# Altium schematic sheet IRIS-EXT-04-BRK_Top.SchDoc
size A3
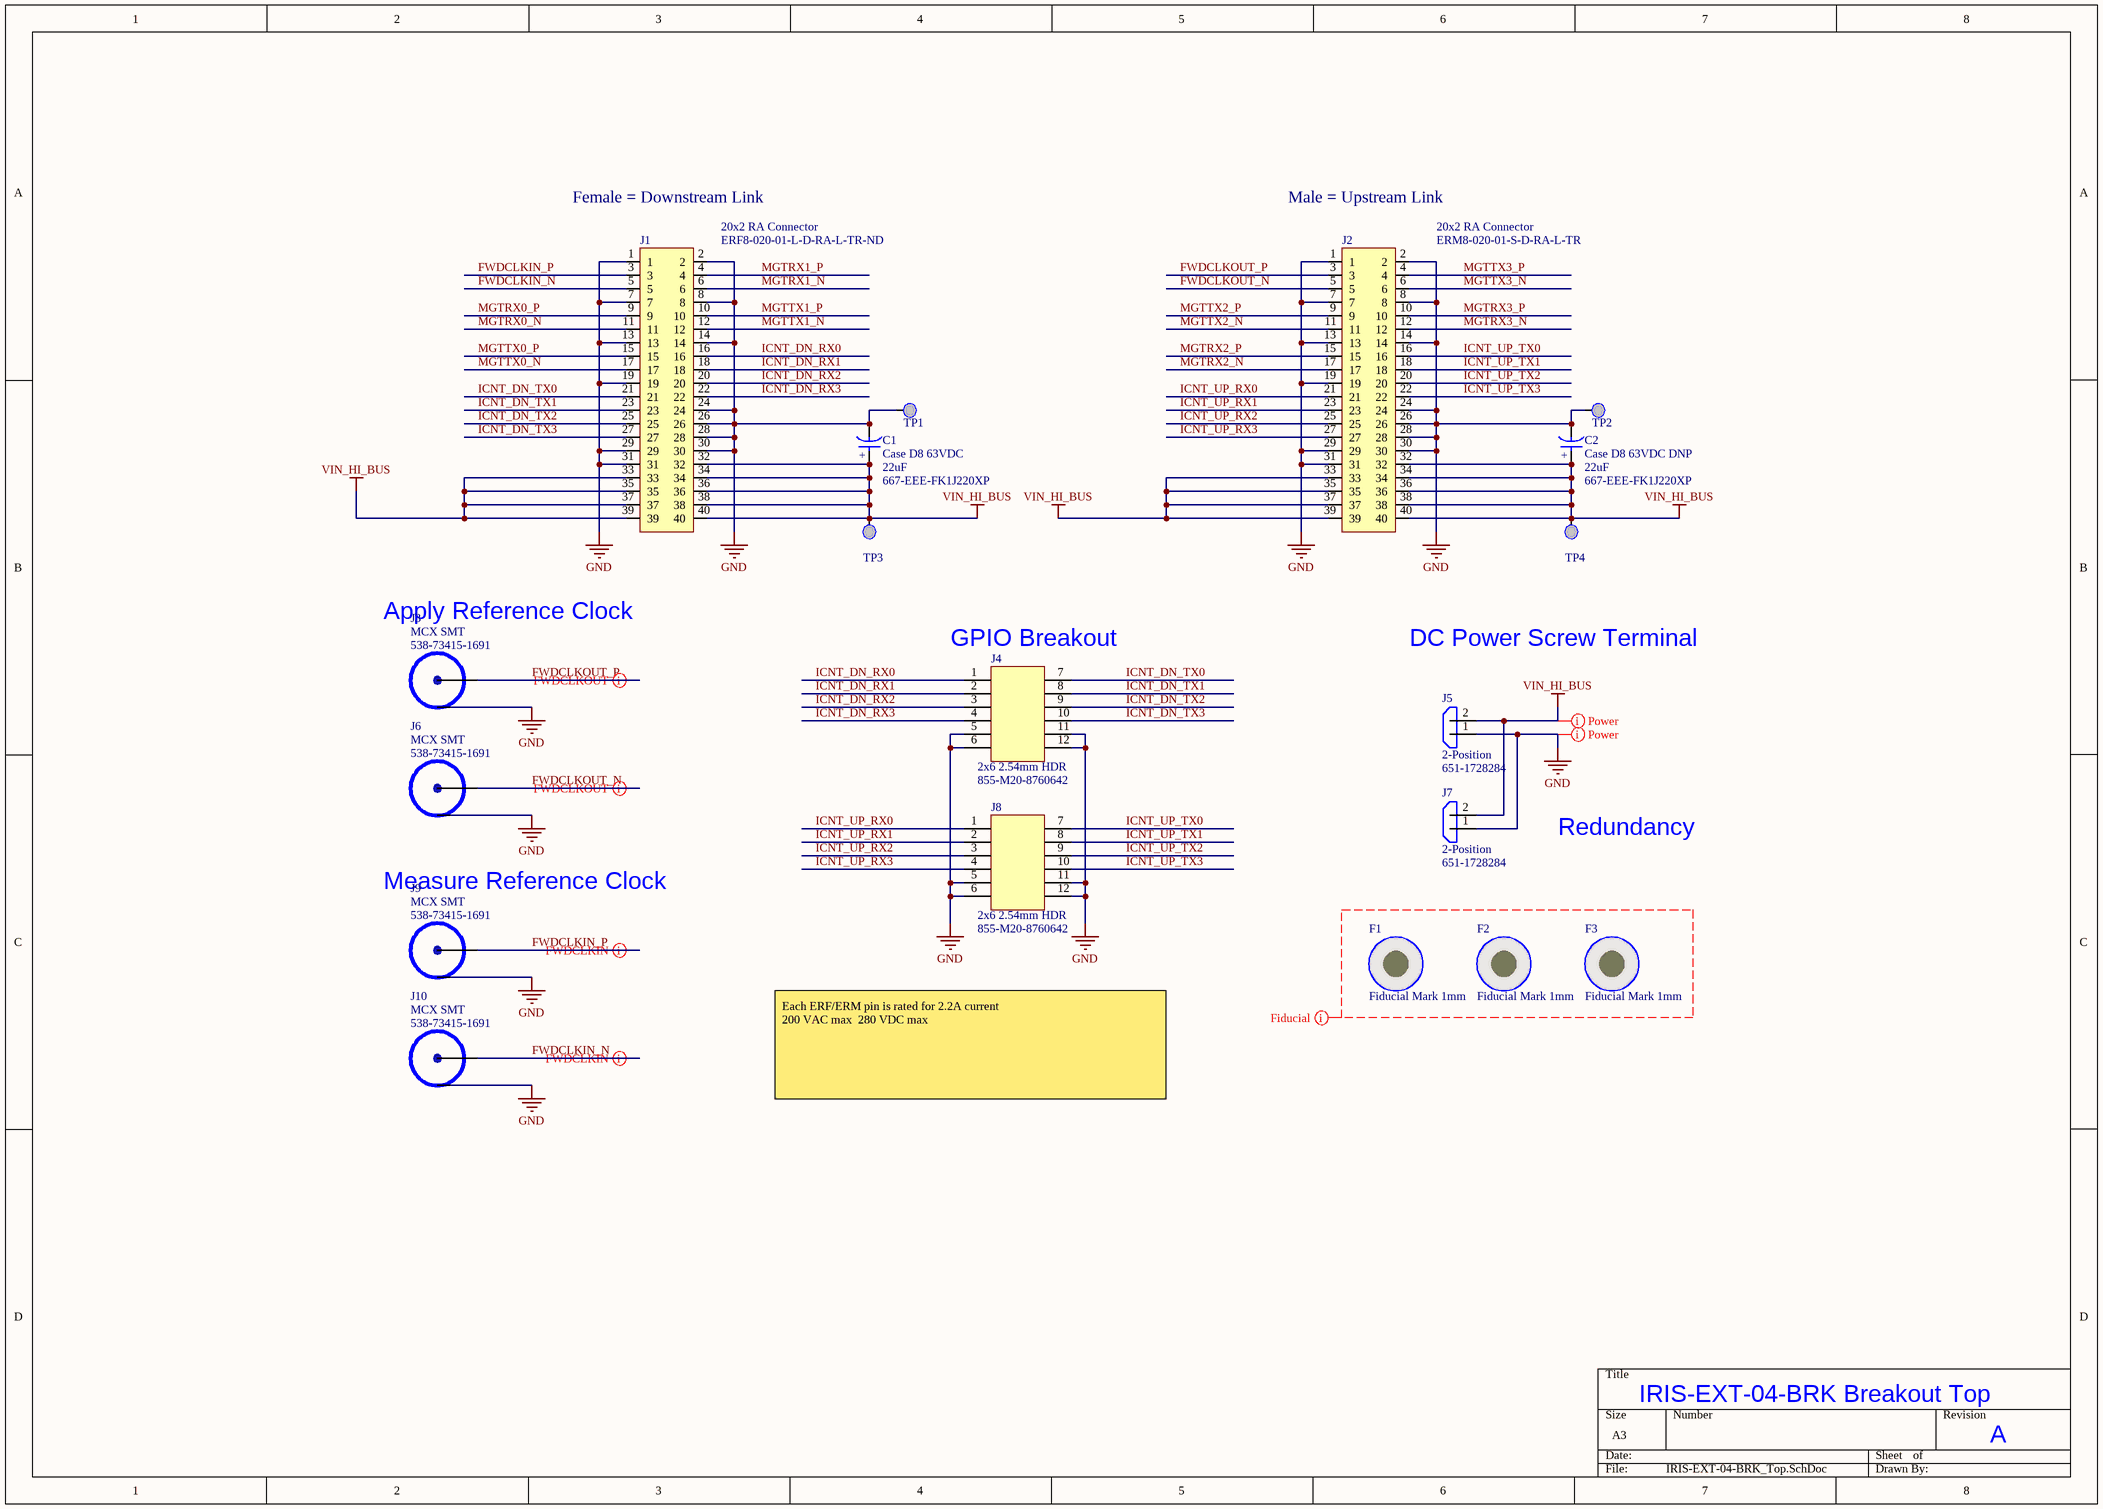
[diagram p0: IRIS-EXT-04-BRK_Top.SchDoc]

## Parts
C1  Case D8 63VDC  value 22uF  Supplier Part Number 1: 667-EEE-FK1J220XP  [Panasonic_SMT_D8]
C2  Case D8 63VDC DNP  value 22uF  Supplier Part Number 1: 667-EEE-FK1J220XP  [Panasonic_SMT_D8]
F1  Fiducial Mark 1mm  [1mm_FIDUCIAL]
F2  Fiducial Mark 1mm  [1mm_FIDUCIAL]
F3  Fiducial Mark 1mm  [1mm_FIDUCIAL]
J1  20x2 RA Connector  Supplier Part Number 1: ERF8-020-01-L-D-RA-L-TR-ND  [ERF8-020-01-L-D-RA-L-TR]
J2  20x2 RA Connector  [ERM8-020-01-S-D-RA-L-TR]
J3  MCX SMT  Supplier Part Number 1: 538-73415-1691  [Molex-734151691]
J4  2x6 2.54mm HDR  Supplier Part Number 1: 855-M20-8760642  [M20-876-350012]
J5  2-Position  Supplier Part Number 1: 651-1728284  [Phoenix-1728284]
J6  MCX SMT  Supplier Part Number 1: 538-73415-1691  [Molex-734151691]
J7  2-Position  Supplier Part Number 1: 651-1728284  [Phoenix-1728284]
J8  2x6 2.54mm HDR  Supplier Part Number 1: 855-M20-8760642  [M20-876-350012]
J9  MCX SMT  Supplier Part Number 1: 538-73415-1691  [Molex-734151691]
J10  MCX SMT  Supplier Part Number 1: 538-73415-1691  [Molex-734151691]
TP1  Testpoint  [Keystone-Red-TP]  (value not drawn)
TP2  Testpoint  [Keystone-Red-TP]  (value not drawn)
TP3  Testpoint  [Keystone-Red-TP]  (value not drawn)
TP4  Testpoint  [Keystone-Red-TP]  (value not drawn)

## Nets
GND: C1.K C2.K J1.1 J1.2 J1.7 J1.8 J1.13 J1.14 J1.19 J1.24 J1.26 J1.28 J1.29 J1.30 J1.31 J2.1 J2.2 J2.7 J2.8 J2.13 J2.14 J2.19 J2.24 J2.26 J2.28 J2.29 J2.30 J2.31 J3.0(GND) J4.5 J4.6 J4.11 J4.12 J5.1 J6.0(GND) J7.1 J8.5 J8.6 J8.11 J8.12 J9.0(GND) J10.0(GND) TP1.0 TP2.0
VIN_HI_BUS: C1.A C2.A J1.32 J1.33 J1.34 J1.35 J1.36 J1.37 J1.38 J1.39 J1.40 J2.32 J2.33 J2.34 J2.35 J2.36 J2.37 J2.38 J2.39 J2.40 J5.2 J7.2 TP3.0 TP4.0
FWDCLKIN_N: J1.5 J10.1(SIG)
FWDCLKIN_P: J1.3 J9.1(SIG)
FWDCLKOUT_N: J2.5 J6.1(SIG)
FWDCLKOUT_P: J2.3 J3.1(SIG)
ICNT_DN_RX0: J1.16 J4.1
ICNT_DN_RX1: J1.18 J4.2
ICNT_DN_RX2: J1.20 J4.3
ICNT_DN_RX3: J1.22 J4.4
ICNT_DN_TX0: J1.21 J4.7
ICNT_DN_TX1: J1.23 J4.8
ICNT_DN_TX2: J1.25 J4.9
ICNT_DN_TX3: J1.27 J4.10
ICNT_UP_RX0: J2.21 J8.1
ICNT_UP_RX1: J2.23 J8.2
ICNT_UP_RX2: J2.25 J8.3
ICNT_UP_RX3: J2.27 J8.4
ICNT_UP_TX0: J2.16 J8.7
ICNT_UP_TX1: J2.18 J8.8
ICNT_UP_TX2: J2.20 J8.9
ICNT_UP_TX3: J2.22 J8.10
MGTRX0_N: J1.11
MGTRX0_P: J1.9
MGTRX1_N: J1.6
MGTRX1_P: J1.4
MGTRX2_N: J2.17
MGTRX2_P: J2.15
MGTRX3_N: J2.12
MGTRX3_P: J2.10
MGTTX0_N: J1.17
MGTTX0_P: J1.15
MGTTX1_N: J1.12
MGTTX1_P: J1.10
MGTTX2_N: J2.11
MGTTX2_P: J2.9
MGTTX3_N: J2.6
MGTTX3_P: J2.4

## Layout directives
net class Power: GND, VIN_HI_BUS
net class Fiducial: (no net found under the mark)
differential pair: FWDCLKIN_N, FWDCLKIN_P, FWDCLKOUT_N, FWDCLKOUT_P

## Notes on the sheet
- Female = Downstream Link
- Male = Upstream Link
- Apply Reference Clock
- (near J4) GPIO Breakout
- DC Power Screw Terminal
- Redundancy
- Measure Reference Clock
- Each ERF/ERM pin is rated for 2.2A current
  200 VAC max  280 VDC max
- IRIS-EXT-04-BRK Breakout Top
- A
- (in symbol Cap_Electrolytic_SMT_D8) +

## Library data of the parts
C1 C2 = Cap_Electrolytic_SMT_D8: Electrolytic SMT Capacitor, Case D8; Supplier 1: Mouser
F1-F3 = Fiducial-1mm
J1 = ERF8-020-01-L-D-RA-L-TR: Samtec ERF8-020 Female Right-Angle with Latch; Supplier 1: Digi-Key; Supplier 2: Samtec; Supplier Part Number 2: ERF8-020-01-L-D-RA-L-TR-ND; Manufacturer 1: Samtec; Manufacturer Part Number 1: ERF8-020-01-L-D-RA-L-TR-ND
J2 = ERM8-020-01-S-D-RA-L-TR: Samtec ERM8-020 Male Right-Angle with Latch; Supplier 1: Samtec; Supplier Part Number 1: ERM8-020-01-S-D-RA-L-TR; Manufacturer 1: Samtec; Manufacturer Part Number 1: ERM8-020-01-S-D-RA-L-TR
J3 J6 J9 J10 = Molex-734151691: Molex 50 Ohm SMT MCX Jack; Supplier 1: Mouser
J4 J8 = M20-8760642: Harwin 2.54mm Thru Straight Recepticle; Supplier 1: Mouser
J5 J7 = Phoenix-1728284: Phoenix Angled Thru Screw Terminal Block 2-Pos; Supplier 1: Mouser
TP1-TP4 = Keystone-5000-5004-Red-TP: Red Through Mount Probe Testpoint; Supplier 1: Mouser; Supplier Part Number 1: 534-5000